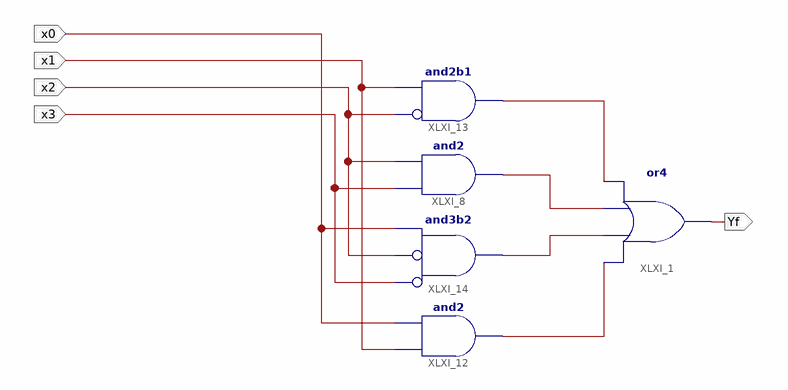
[diagram p0: schematic sheet 1]
// Xilinx ISE schematic decoder.sch (spartan6) as structural Verilog: 5 symbols, 5 ports
module decoder (
  input  x0,
  input  x3,
  input  x1,
  input  x2,
  output Yf
);

  wire XLXN_1, XLXN_2, XLXN_3, XLXN_36;

  or XLXI_1 (Yf, XLXN_36, XLXN_3, XLXN_1, XLXN_2);
  and XLXI_8 (XLXN_1, x3, x2);
  and XLXI_12 (XLXN_36, x1, x0);
  and XLXI_13 (XLXN_2, ~x2, x1);  // and2b1
  and XLXI_14 (XLXN_3, ~x3, ~x2, x0);  // and3b2
endmodule
